# EAGLE design Intar_Vibration_Module (EAGLE 7.3.0)
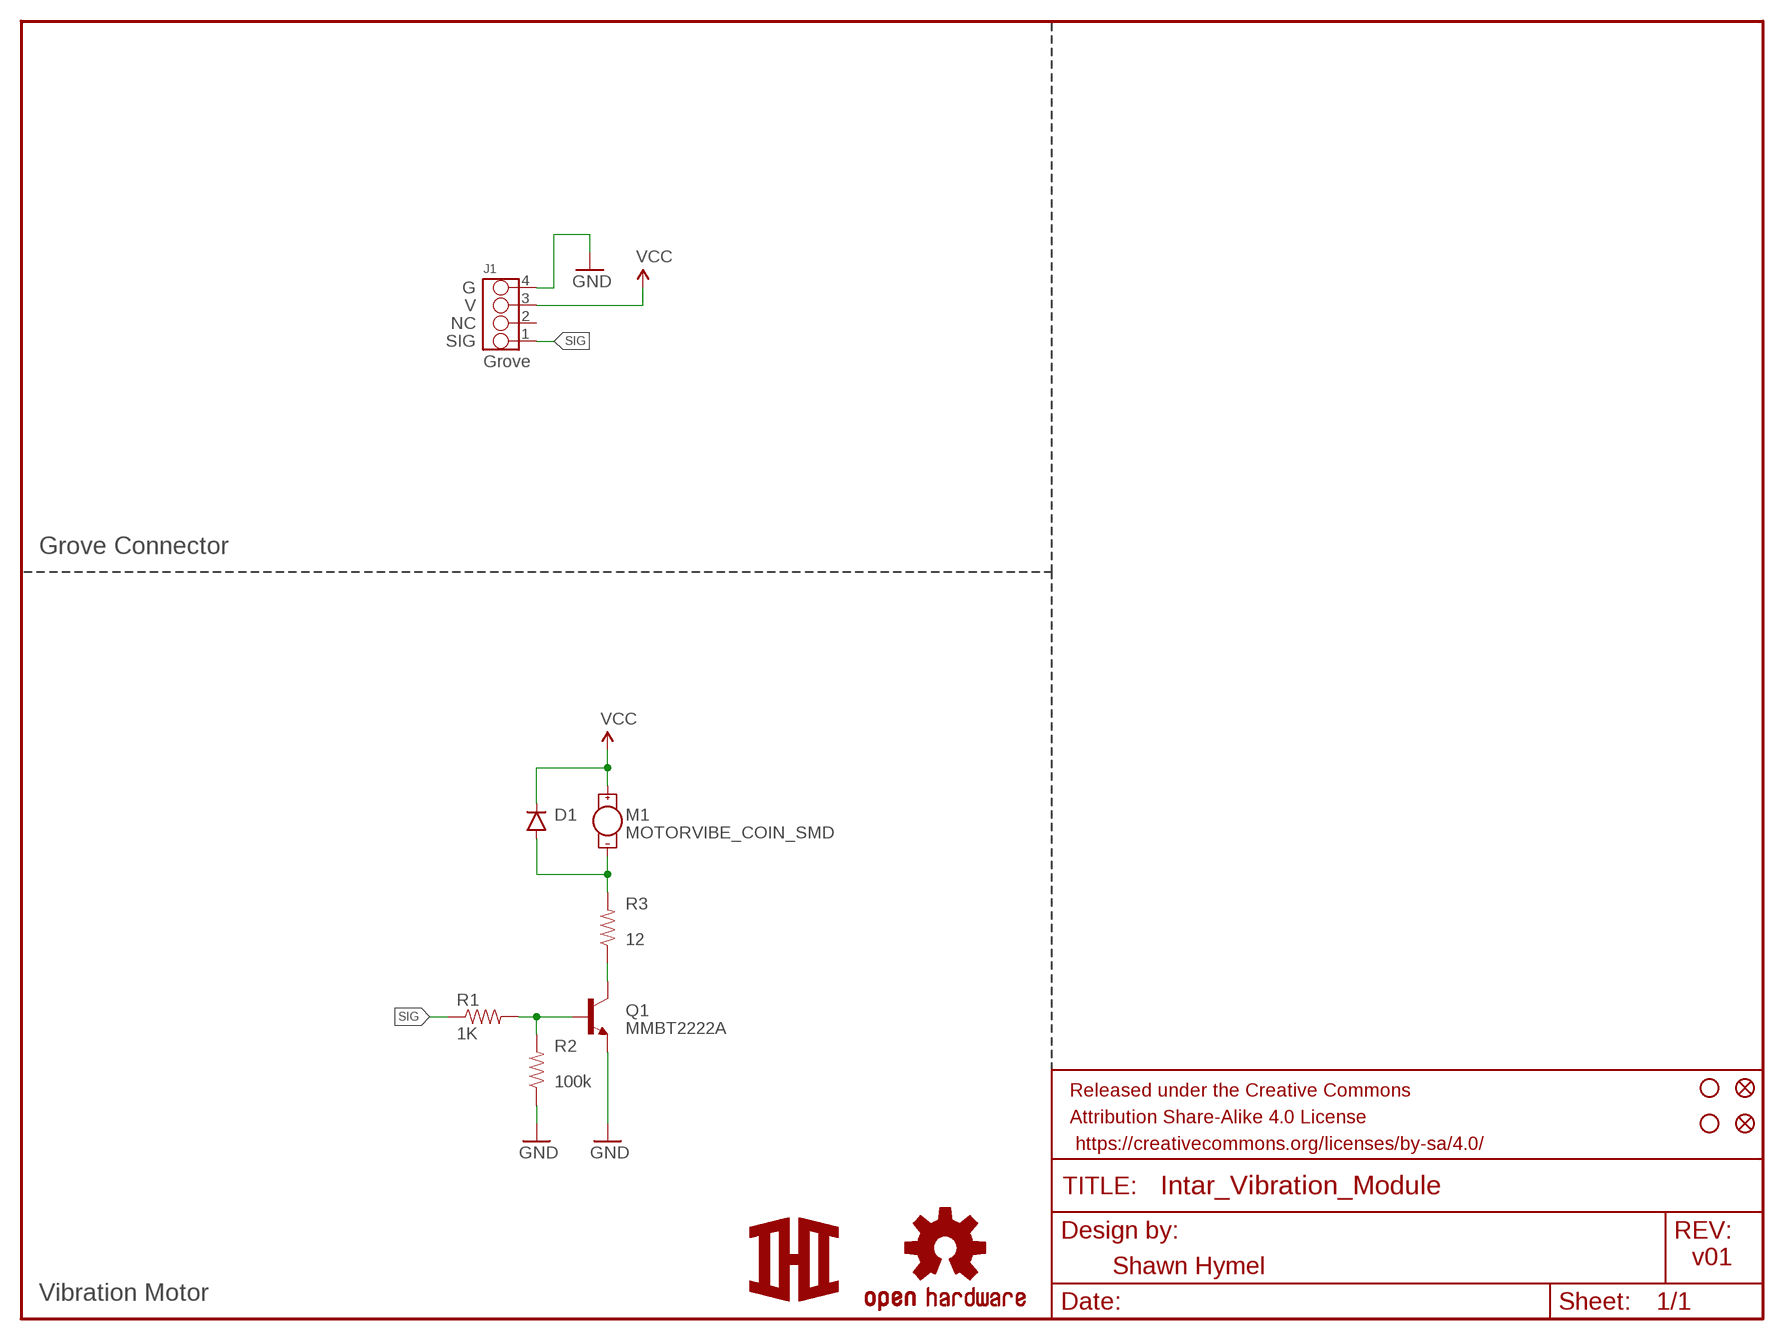
[diagram p0: schematic, sheet 1]

## Parts
D1  250mA/100V  DIODEBAS16  [SOD-323]
FID1  FIDUCIAL1X2  [FIDUCIAL-1X2]
FID2  FIDUCIAL1X2  [FIDUCIAL-1X2]
FRAME1  FRAME-LETTER  [CREATIVE_COMMONS]
J1  GROVE-4P-2.0-3470130P1  [4P-2.0]
LOGO1  OSHW-LOGOS  [OSHW-LOGO-S]
M1  MOTORVIBE_COIN_SMD  [VIBE_COIN_SMD]
Q1  MMBT2222A  TRANSISTOR_NPNMMBT2222A  [SOT23-3]
R1  1K  1KOHM-1/10W-1%(0603)  [0603-RES]
R2  100k  100KOHM-1/10W-1%(0603)  [0603-RES]
R3  12  RESISTOR0603  [0603-RES]
STANDOFF1  STAND-OFF  [STAND-OFF]
STANDOFF2  STAND-OFF  [STAND-OFF]
U$1  LOGOSM  [LOGO_SM]

## Nets
GND: J1.4 Q1.2(E) R2.1
N$2: Q1.1(B) R1.2 R2.2
N$5: Q1.3(C) R3.1
N$6: D1.A M1.2(-) R3.2
SIG: J1.1 R1.1
VCC: D1.C J1.3 M1.1(+)
Unconnected: J1.2

## Notes on the sheet
- G
- V
- NC
- SIG
- Grove
- Grove Connector
- v01
- Shawn Hymel
- Vibration Motor

## Library data of the parts
D1 = SparkFun-DiscreteSemi:DIODE: Diode These are standard reverse protection diodes and small signal diodes. SMA package can handle up to about 1A. SOD-323 can handle about 200mA. What the SOD-323 package when ordering, there are some mfgs out there that are 5-pin packages.; PROD_ID: DIO-09646
FID1 FID2 = SparkFun-Aesthetics:FIDUCIAL: Fiducial Alignment Points Various fiducial points for machine vision alignment.
FRAME1 = SparkFun-Aesthetics:FRAME-LETTER: Schematic Frame Standard 8.5x11 US Letter frame
J1 = Connector:GROVE-4P-2.0
LOGO1 = SparkFun-Aesthetics:OSHW-LOGO: Open Source Hardware Logo This logo indicates the piece of hardware it is found on incorporates a OSHW license and/or adheres to the definition of open source hardware found here: http://freedomdefined.org/OSHW
M1 = Intar_Eagle_Library:MOTOR
Q1 = SparkFun-DiscreteSemi:TRANSISTOR_NPN: Generic NPN BJT MMBT2222A - TRANS-08049 (SOT-23, 1A 40V) MPSA42 - TRANS-09116 (SOT-23, 500mA 300V) MMBT5088LT1G - TRANS-11160 (SOT-23, 50 mA 30V) BC547 - COM-08928 <http://www.sparkfun.com/products/8928> (TO-92 45V 100mA) (1.Collector 2.Base 3.Emitter) 2N3904 - COM-00521 <http://www.sparkfun.com/products/521> (TO-92 40V 200mA) (1.Emitter 2.Base 3.Collector) P2N2222A - COM-12852 <http://www.sparkfun.com/products/12852> (TO-92 40V 600mA) (1.Collector 2.Base 3.Emitter); PROD_ID: TRANS-08049
R1 = SparkFun-Resistors:1KOHM-1/10W-1%(0603): RES-07856; PROD_ID: RES-07856
R2 = SparkFun-Resistors:100KOHM-1/10W-1%(0603): RES-07828; PROD_ID: RES-07828
R3 = SparkFun-Resistors:RESISTOR: Resistor Basic schematic elements and footprints for 0603, 1206, and PTH resistors.
STANDOFF1 STANDOFF2 = SparkFun-Electromechanical:STAND-OFF: #4 Stand Off This is the mechanical footprint for a #4 phillips button head screw. Use the keepout ring to avoid running the screw head into surrounding components. SKU : PRT-00447
U$1 = Intar_Eagle_Library:LOGO

## Board
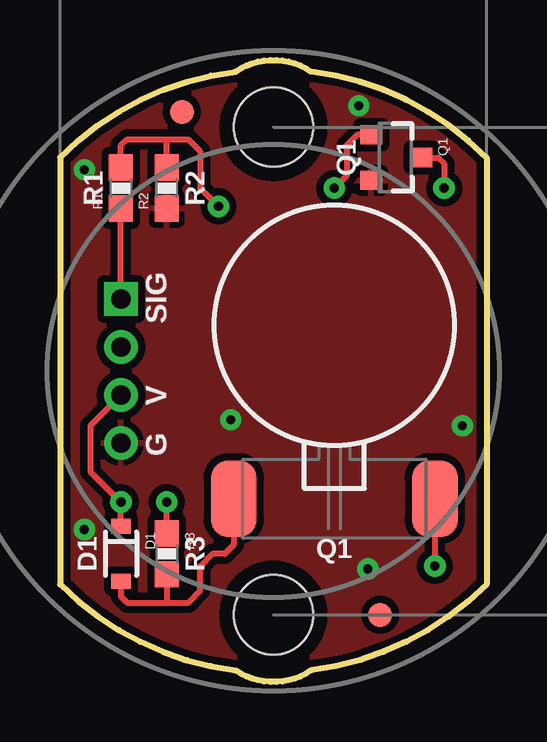
[diagram p1: board, top side]
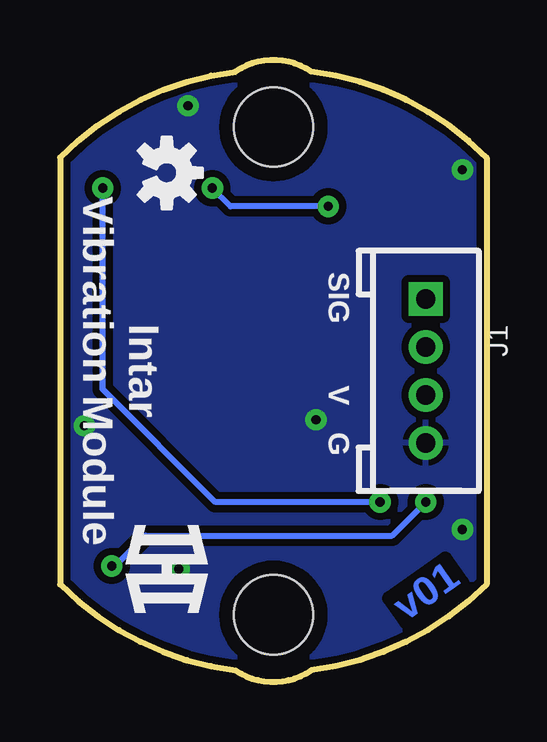
[diagram p2: board, bottom side, seen from below]

Size 17.78 x 25.91 mm. Coordinates in mm from the lower left corner, seen from the top.
Outline: 17.78,21.85 17.78,4.07 arc-38 10.46,0.48 arc-69 7.32,0.48 arc-38 0,4.07 0,21.85 arc-38 7.32,25.43 arc-69 10.46,25.43 arc-38 17.78,21.85
Copper layers (1*16): Top 0.035mm / dielectric 1.5mm / Bottom 0.035mm
Design rules "SparkFun-2-layer": minimum track width 7mil, minimum drill 15mil, track to track 8mil, track to pad 8mil, pad to pad 8mil, via to via 8mil, smd to smd 8mil, copper to edge 8mil, drill to drill 8mil, minimum pad ring 12mil, minimum via ring 10mil, stop-mask expansion 4mil, vias tented up to drill 20mil, thermal gap 10mil

### Footprints (pad centres in the part's own frame; a part is rotated, then mirrored left to right if it is on the bottom)
SOD-323 = smd 0.63 x 0.83: A 1.15,0; C -1.15,0
FIDUCIAL-1X2 = smd 1 x 1: 1 0,0
4P-2.0 = drill 0.8 pad 1.27 square: 1 -3,0 | drill 0.8 pad 1.27: 2 -1,0; 3 1,0; 4 3,0
VIBE_COIN_SMD = smd 1.905 x 3.175: 1 4.191,-7.229; 2 -4.191,-7.229
SOT23-3 = smd 0.8 x 0.9: 1 -0.95,-1; 2 0.95,-1; 3 0,1.1
0603-RES = smd 1.1 x 1: 1 -0.85,0; 2 0.85,0
STAND-OFF = hole 3.302: 0,0

### Placement (x,y rotation side)
D1  2.54,5.34 270 top
FID1  13.34,2.8 0 top
FID2  5.08,23.75 0 top
FRAME1  -24.13,-9.9 0 top  (outside the outline)
J1  2.54,12.96 270 bottom
LOGO1  13.34,21.21 270 bottom
M1  11.43,14.86 0 top
Q1  13.97,21.85 270 top
R1  2.54,20.58 90 top
R2  4.45,20.58 90 top
R3  4.45,5.34 270 top
STANDOFF1  8.89,23.12 0 top
STANDOFF2  8.89,2.8 0 top
U$1  13.34,4.7 270 bottom

### Tracks (layer width: path | path; a pad name or v marks a point on that pad's centre or on a via)
GND  (via drill 0.38)
  other vias: 1.02,21.34 1.02,6.35 12.83,4.7 16.76,10.67 12.45,24 7.11,10.92
  pour Top (isolate 0.305): 0,26.93 0,-1.01 17.78,-1.01 17.78,26.93
  pour Bottom (isolate 0.305): 0,26.93 17.78,26.93 17.78,-1.01 0,-1.01
N$2  (via drill 0.38)
  Top 0.254: R1.2 2.54,22.35 2.79,22.61 4.45,22.61 | 4.45,22.61 5.33,22.61 5.84,22.1 5.84,20.58 v6.6,19.81 | R2.2 4.45,22.61 | Q1.1 12.38,22.8 11.94,22.35 11.94,21.08 v11.43,20.58
  Bottom 0.254: v6.6,19.81 10.67,19.81 v11.43,20.58
N$5  (via drill 0.38)
  Top 0.254: R3.1 v4.45,7.49 | Q1.3 15.75,21.85 16,21.59 v16,20.58
  Bottom 0.254: v4.45,7.49 11.3,7.49 16,12.19 v16,20.58
N$6
  Top 0.254: D1.A 2.54,3.56 2.79,3.3 4.45,3.3 | 4.45,3.3 5.33,3.3 5.84,3.81 5.84,4.83 6.35,5.34 6.86,5.34 7.24,5.72 M1.2 | R3.2 4.45,3.3
SIG
  Top 0.254: J1.1 R1.1
VCC  (via drill 0.38)
  Top 0.254: J1.3 2.54,11.94 1.27,10.67 1.27,8.76 v2.54,7.49 D1.C | M1.1 v15.62,4.83
  Bottom 0.254: v15.62,4.83 15.49,4.83 14.22,6.1 3.94,6.1 v2.54,7.49

### Text on the board
Bottom: v01
tPlace: Q1 | R1 | R2 | SIG | V | G | Q1 | D1 | R3
bPlace: SIG | Intar / Vibration Module | V | G
tDocu: Shawn Hymel